# Altium schematic sheet Ledy.SchDoc
size A4; SheetNumber: 6; SheetTotal: 6
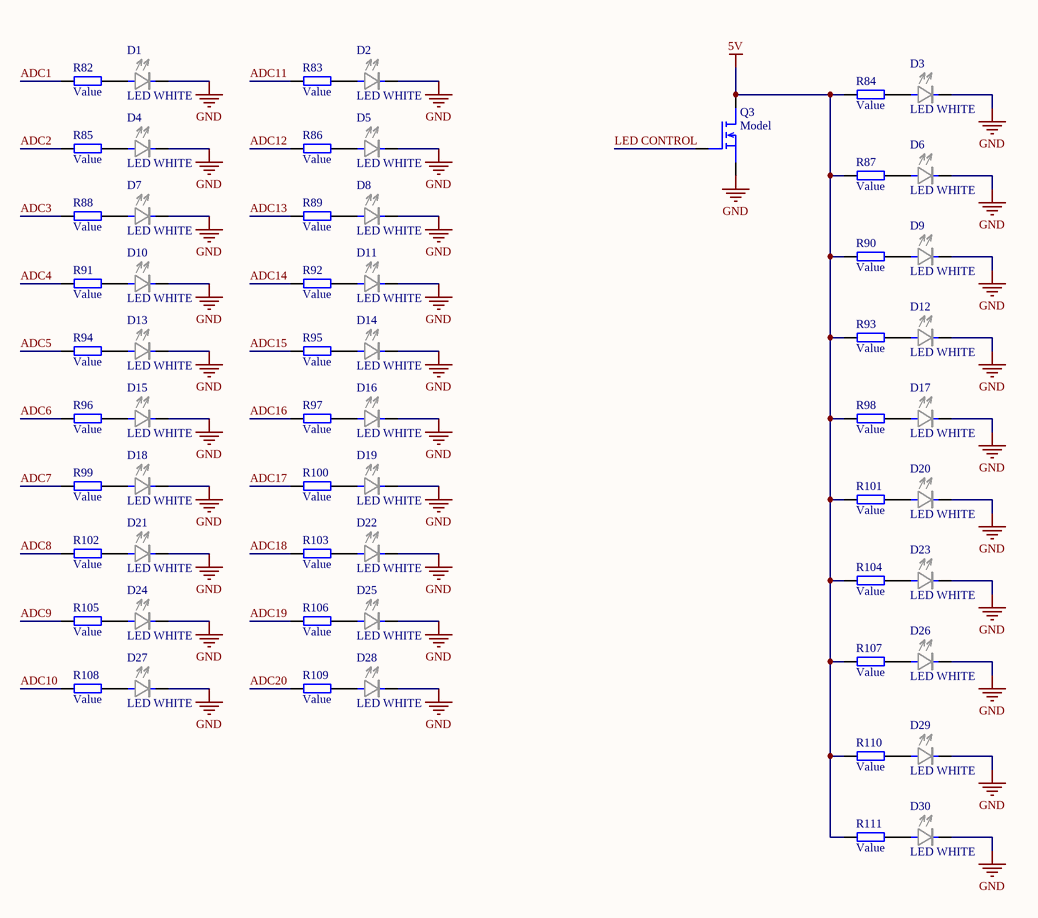
[diagram p0: Ledy.SchDoc]

## Parts
D1  LED WHITE  [LED 0603 White]
D2  LED WHITE  [LED 0603 White]
D3  LED WHITE  [LED 0603 White]
D4  LED WHITE  [LED 0603 White]
D5  LED WHITE  [LED 0603 White]
D6  LED WHITE  [LED 0603 White]
D7  LED WHITE  [LED 0603 White]
D8  LED WHITE  [LED 0603 White]
D9  LED WHITE  [LED 0603 White]
D10  LED WHITE  [LED 0603 White]
D11  LED WHITE  [LED 0603 White]
D12  LED WHITE  [LED 0603 White]
D13  LED WHITE  [LED 0603 White]
D14  LED WHITE  [LED 0603 White]
D15  LED WHITE  [LED 0603 White]
D16  LED WHITE  [LED 0603 White]
D17  LED WHITE  [LED 0603 White]
D18  LED WHITE  [LED 0603 White]
D19  LED WHITE  [LED 0603 White]
D20  LED WHITE  [LED 0603 White]
D21  LED WHITE  [LED 0603 White]
D22  LED WHITE  [LED 0603 White]
D23  LED WHITE  [LED 0603 White]
D24  LED WHITE  [LED 0603 White]
D25  LED WHITE  [LED 0603 White]
D26  LED WHITE  [LED 0603 White]
D27  LED WHITE  [LED 0603 White]
D28  LED WHITE  [LED 0603 White]
D29  LED WHITE  [LED 0603 White]
D30  LED WHITE  [LED 0603 White]
Q3  Model  [SOT323]
R82  Value  [R 0603]
R83  Value  [R 0603]
R84  Value  [R 0603]
R85  Value  [R 0603]
R86  Value  [R 0603]
R87  Value  [R 0603]
R88  Value  [R 0603]
R89  Value  [R 0603]
R90  Value  [R 0603]
R91  Value  [R 0603]
R92  Value  [R 0603]
R93  Value  [R 0603]
R94  Value  [R 0603]
R95  Value  [R 0603]
R96  Value  [R 0603]
R97  Value  [R 0603]
R98  Value  [R 0603]
R99  Value  [R 0603]
R100  Value  [R 0603]
R101  Value  [R 0603]
R102  Value  [R 0603]
R103  Value  [R 0603]
R104  Value  [R 0603]
R105  Value  [R 0603]
R106  Value  [R 0603]
R107  Value  [R 0603]
R108  Value  [R 0603]
R109  Value  [R 0603]
R110  Value  [R 0603]
R111  Value  [R 0603]

## Nets
5V: Q3.3(D) R84.1 R87.1 R90.1 R93.1 R98.1 R101.1 R104.1 R107.1 R110.1 R111.1
GND: D1.2 D2.2 D3.2 D4.2 D5.2 D6.2 D7.2 D8.2 D9.2 D10.2 D11.2 D12.2 D13.2 D14.2 D15.2 D16.2 D17.2 D18.2 D19.2 D20.2 D21.2 D22.2 D23.2 D24.2 D25.2 D26.2 D27.2 D28.2 D29.2 D30.2 Q3.2(S)
ADC1: R82.1
ADC2: R85.1
ADC3: R88.1
ADC4: R91.1
ADC5: R94.1
ADC6: R96.1
ADC7: R99.1
ADC8: R102.1
ADC9: R105.1
ADC10: R108.1
ADC11: R83.1
ADC12: R86.1
ADC13: R89.1
ADC14: R92.1
ADC15: R95.1
ADC16: R97.1
ADC17: R100.1
ADC18: R103.1
ADC19: R106.1
ADC20: R109.1
LED CONTROL: Q3.1(G)
NetD1_1: D1.1 R82.2
NetD2_1: D2.1 R83.2
NetD3_1: D3.1 R84.2
NetD4_1: D4.1 R85.2
NetD5_1: D5.1 R86.2
NetD6_1: D6.1 R87.2
NetD7_1: D7.1 R88.2
NetD8_1: D8.1 R89.2
NetD9_1: D9.1 R90.2
NetD10_1: D10.1 R91.2
NetD11_1: D11.1 R92.2
NetD12_1: D12.1 R93.2
NetD13_1: D13.1 R94.2
NetD14_1: D14.1 R95.2
NetD15_1: D15.1 R96.2
NetD16_1: D16.1 R97.2
NetD17_1: D17.1 R98.2
NetD18_1: D18.1 R99.2
NetD19_1: D19.1 R100.2
NetD20_1: D20.1 R101.2
NetD21_1: D21.1 R102.2
NetD22_1: D22.1 R103.2
NetD23_1: D23.1 R104.2
NetD24_1: D24.1 R105.2
NetD25_1: D25.1 R106.2
NetD26_1: D26.1 R107.2
NetD27_1: D27.1 R108.2
NetD28_1: D28.1 R109.2
NetD29_1: D29.1 R110.2
NetD30_1: D30.1 R111.2

## Library data of the parts
Q3 = N Mosfet: General Pourpouse Mosfet
R82-R111 = Resistor: General pourpouse resistor